# Altium schematic sheet ethernet.SchDoc
size A
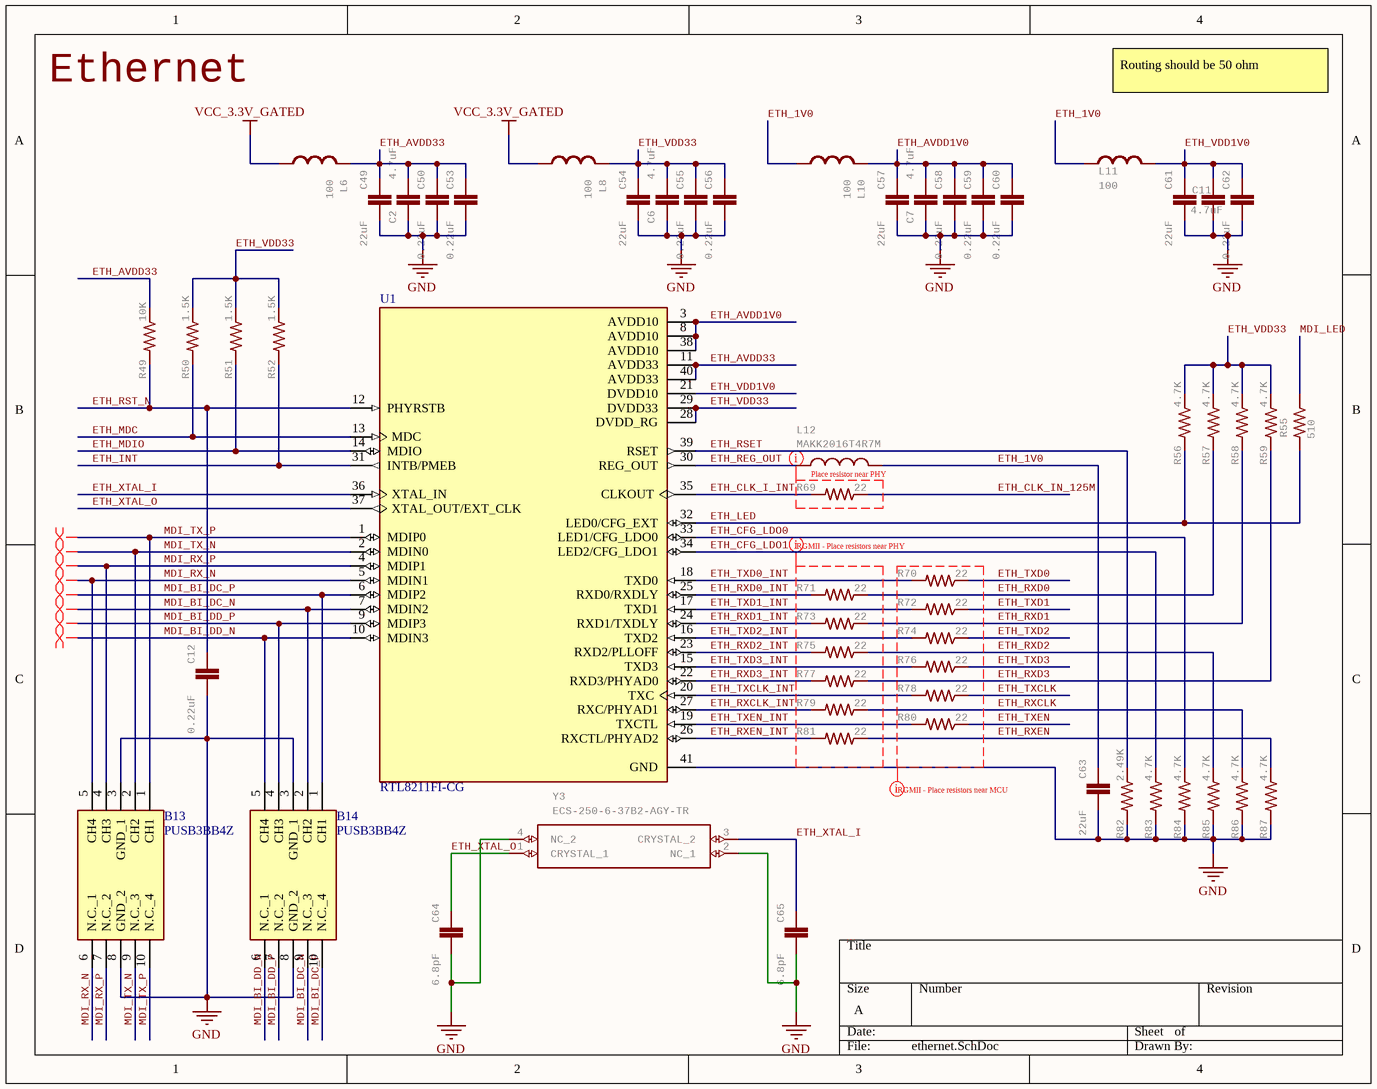
[diagram p0: ethernet.SchDoc]

## Parts
B13  PUSB3BB4Z  [SON50P100X250X50-10N]
B14  PUSB3BB4Z  [SON50P100X250X50-10N]
C2  4.7uF  [0402-CAP]
C6  4.7uF  [0402-CAP]
C7  4.7uF  [0402-CAP]
C11  4.7uF  [0402-CAP]
C12  0.22uF  [C0201]
C49  22uF  [0603-CAP]
C50  0.22uF  [C0201]
C53  0.22uF  [C0201]
C54  22uF  [0603-CAP]
C55  0.22uF  [C0201]
C56  0.22uF  [C0201]
C57  22uF  [0603-CAP]
C58  0.22uF  [C0201]
C59  0.22uF  [C0201]
C60  0.22uF  [C0201]
C61  22uF  [0603-CAP]
C62  0.22uF  [C0201]
C63  22uF  [0603-CAP]
C64  6.8pF  [C0201]
C65  6.8pF  [C0201]
L6  100  [C0402]
L8  100  [C0402]
L10  100  [C0402]
L11  100  [C0402]
L12  MAKK2016T4R7M  [INDC2016X100N]
R49  10K  [R0201]
R50  1.5K  [R0201]
R51  1.5K  [R0201]
R52  1.5K  [R0201]
R55  510  [0402-RES]
R56  4.7K  [R0201]
R57  4.7K  [R0201]
R58  4.7K  [R0201]
R59  4.7K  [R0201]
R69  22  [R0201]
R70  22  [R0201]
R71  22  [R0201]
R72  22  [R0201]
R73  22  [R0201]
R74  22  [R0201]
R75  22  [R0201]
R76  22  [R0201]
R77  22  [R0201]
R78  22  [R0201]
R79  22  [R0201]
R80  22  [R0201]
R81  22  [R0201]
R82  2.49K  [R0201]
R83  4.7K  [R0201]
R84  4.7K  [R0201]
R85  4.7K  [R0201]
R86  4.7K  [R0201]
R87  4.7K  [R0201]
U1  RTL8211FI-CG  [RTL8211FI-CG]
Y3  ECS-250-6-37B2-AGY-TR  [XRCGB24M000F3M00R0]

## Nets
GND: B13.3(GND_1) B13.8(GND_2) B14.3(GND_1) B14.8(GND_2) C2.1 C6.1 C7.1 C11.1 C12.2 C49.2 C50.2 C53.2 C54.2 C55.2 C56.2 C57.2 C58.2 C59.2 C60.2 C61.2 C62.2 C63.2 C64.2 C65.2 R82.2 R83.2 R84.2 R85.2 R86.2 R87.2 U1.41(GND) Y3.2(NC_1) Y3.4(NC_2)
VCC_3.3V_GATED: L6.1 L8.1
ETH_1V0: C63.1 L10.1 L11.1 L12.2
ETH_AVDD1V0: C7.2 C57.1 C58.1 C59.1 C60.1 L10.2 U1.3(AVDD10) U1.8(AVDD10) U1.38(AVDD10)
ETH_AVDD33: C2.2 C49.1 C50.1 C53.1 L6.2 R49.1 U1.11(AVDD33) U1.40(AVDD33)
ETH_CFG_LDO0: R84.1 U1.33(LED1/CFG_LDO0)
ETH_CFG_LDO1: R83.1 U1.34(LED2/CFG_LDO1)
ETH_CLK_I_INT: R69.2 U1.35(CLKOUT)
ETH_CLK_IN_125M: R69.1
ETH_INT: R52.2 U1.31(INTB/PMEB)
ETH_LED: R55.2 R56.2 U1.32(LED0/CFG_EXT)
ETH_MDC: R50.2 U1.13(MDC)
ETH_MDIO: R51.2 U1.14(MDIO)
ETH_REG_OUT: L12.1 U1.30(REG_OUT)
ETH_RSET: R82.1 U1.39(RSET)
ETH_RST_N: C12.1 R49.2 U1.12(PHYRSTB)
ETH_RXCLK: R79.1 R86.1
ETH_RXCLK_INT: R79.2 U1.27(RXC/PHYAD1)
ETH_RXD0: R57.2 R71.1
ETH_RXD0_INT: R71.2 U1.25(RXD0/RXDLY)
ETH_RXD1: R58.2 R73.1
ETH_RXD1_INT: R73.2 U1.24(RXD1/TXDLY)
ETH_RXD2: R75.1 R85.1
ETH_RXD2_INT: R75.2 U1.23(RXD2/PLLOFF)
ETH_RXD3: R59.2 R77.1
ETH_RXD3_INT: R77.2 U1.22(RXD3/PHYAD0)
ETH_RXEN: R81.1 R87.1
ETH_RXEN_INT: R81.2 U1.26(RXCTL/PHYAD2)
ETH_TXCLK: R78.1
ETH_TXCLK_INT: R78.2 U1.20(TXC)
ETH_TXD0: R70.1
ETH_TXD0_INT: R70.2 U1.18(TXD0)
ETH_TXD1: R72.1
ETH_TXD1_INT: R72.2 U1.17(TXD1)
ETH_TXD2: R74.1
ETH_TXD2_INT: R74.2 U1.16(TXD2)
ETH_TXD3: R76.1
ETH_TXD3_INT: R76.2 U1.15(TXD3)
ETH_TXEN: R80.1
ETH_TXEN_INT: R80.2 U1.19(TXCTL)
ETH_VDD1V0: C11.2 C61.1 C62.1 L11.2 U1.21(DVDD10)
ETH_VDD33: C6.2 C54.1 C55.1 C56.1 L8.2 R50.1 R51.1 R52.1 R56.1 R57.1 R58.1 R59.1 U1.28(DVDD_RG) U1.29(DVDD33)
ETH_XTAL_I: C65.1 U1.36(XTAL_IN) Y3.3(CRYSTAL_2)
ETH_XTAL_O: C64.1 U1.37(XTAL_OUT/EXT_CLK) Y3.1(CRYSTAL_1)
MDI_BI_DC_N: B14.2(CH2) B14.9(N.C._3) U1.7(MDIN2)
MDI_BI_DC_P: B14.1(CH1) B14.10(N.C._4) U1.6(MDIP2)
MDI_BI_DD_N: B14.5(CH4) B14.6(N.C._1) U1.10(MDIN3)
MDI_BI_DD_P: B14.4(CH3) B14.7(N.C._2) U1.9(MDIP3)
MDI_LED: R55.1
MDI_RX_N: B13.5(CH4) B13.6(N.C._1) U1.5(MDIN1)
MDI_RX_P: B13.4(CH3) B13.7(N.C._2) U1.4(MDIP1)
MDI_TX_N: B13.2(CH2) B13.9(N.C._3) U1.2(MDIN0)
MDI_TX_P: B13.1(CH1) B13.10(N.C._4) U1.1(MDIP0)

## Layout directives
net class RGMII - Place resistors near PHY: (no net found under the mark)
net class RGMII - Place resistors near MCU: GND
differential pair: MDI_BI_DC_N, MDI_BI_DC_P, MDI_BI_DD_N, MDI_BI_DD_P, MDI_RX_N, MDI_RX_P, MDI_TX_N, MDI_TX_P
net class Place resistor near PHY: (no net found under the mark)

## Notes on the sheet
- Ethernet
- Routing should be 50 ohm

## Library data of the parts
B13 B14 = PUSB3BB4Z: PUSB3BB4 - Extremely low capacitance bidirectional ESD protection diode array@en-us; Manufacturer_Name: Nexperia; Geometry.Height: 0.5mm; Mouser Part Number: 771-PUSB3BB4Z; Mouser Price/Stock: https://www.mouser.co.uk/ProductDetail/Nexperia/PUSB3BB4Z?qs=1Kr7Jg1SGW9sIg06EAYF6Q%3D%3D; Manufacturer_Part_Number: PUSB3BB4Z; Datasheet Link: https://assets.nexperia.com/documents/short-data-sheet/PUSB3BB4_SDS.pdf
C2 C6 C7 C11 = CAP0402-CAP: CapacitorStandard 0603 ceramic capacitor, and 0.1" leaded capacitor.; MPN: JMK105BBJ475MV-F; GateName_1: G$1; SymbolName_1: CAP; DeviceName: 0402-CAP; LibraryName: sfe; DeviceSetName: CAP; Part Number: JMK105BBJ475MV-F
C12 C50 C53 C55 C56 C58-C60 C62 = C-EUC0201: CAPACITOR, European symbol; MPN: GRM033R60J224ME15D; GateName_1: G$1; SymbolName_1: C-EU; POPULARITY: 0; DeviceName: C0201; LibraryName: rcl; DeviceSetName: C-EU; SPICEPREFIX: C; Part Number: GRM033R60J224ME15D
C49 C54 C57 C61 C63 = 22UF-0805-6.3V-20%: 22ÂµF ceramic capacitors    A capacitor is a passive two-terminal electrical component used to store electrical energy temporarily in an electric field.; MPN: GRM188R60G226MEA0D; GateName_1: G$1; SymbolName_1: CAP; PROD_ID: CAP-08402; DeviceName: -0805-6.3V-20%; LibraryName: SparkFun-Capacitors; DeviceSetName: 22UF; Part Number: GRM188R60G226MEA0D
C64 C65 = C-EUC0201: CAPACITOR, European symbol; MPN: GRM0335C1H6R8BA01D; GateName_1: G$1; SymbolName_1: C-EU; POPULARITY: 0; DeviceName: C0201; LibraryName: rcl; DeviceSetName: C-EU; SPICEPREFIX: C; Part Number: GRM0335C1H6R8BA01D
L6 L8 L10 L11 = INDUCTOR0402: InductorsBasic Inductor/Choke - 0603 and 1206. Footprints are not proven and vary greatly between part numbers.; MPN: MFBM1V1005-101-R; GateName_1: G$1; DeviceName: 0402; SymbolName_1: INDUCTOR; LibraryName: sfe; DeviceSetName: INDUCTOR; Part Number: MFBM1V1005-101-R
L12 = MAKK2016T2R2M: INDUCTOR, METAL CORE Check availability; GateName_1: G$1; MF: Taiyo Yuden; SymbolName_1: MAKK2016T4R7M; LibraryName: MAKK2016T4R7M; DeviceSetName: MAKK2016T4R7M; AVAILABILITY: In Stock; MP: MAKK2016T4R7M; MPN: MAKK2016T4R7M; PACKAGE: 2016 Taiyo Yuden; PRICE: None; PURCHASE-URL: https://pricing.snapeda.com/search/part/MAKK2016T4R7M/?ref=eda; Part Number: MAKK2016T4R7M
R49 = RESISTOR0402-RES: MPN: CR0201-JW-103GLF; GateName_1: G$1; SymbolName_1: RESISTOR; LibraryName: sfe; DeviceSetName: RESISTOR; Part Number: CR0201-JW-103GLF
R50-R52 = RESISTOR0402-RES: MPN: AC0201JR-071K5L; GateName_1: G$1; SymbolName_1: RESISTOR; LibraryName: sfe; DeviceSetName: RESISTOR; Part Number: AC0201JR-071K5L
R55 = RESISTOR0402-RES: ResistorBasic schematic elements and footprints for 0603, 1206, and PTH resistors.; MPN: RC0402FR-07510RL; GateName_1: G$1; SymbolName_1: RESISTOR; DeviceName: 0402-RES; LibraryName: sfe; DeviceSetName: RESISTOR; Part Number: RC0402FR-07510RL
R56-R59 R83-R87 = RESISTOR0402-RES: MPN: CR0201-FW-4701GLF; GateName_1: G$1; SymbolName_1: RESISTOR; LibraryName: sfe; DeviceSetName: RESISTOR; Part Number: CR0201-FW-4701GLF
R69-R81 = RESISTOR0402-RES: MPN: CR0201-JW-220GLF; GateName_1: G$1; SymbolName_1: RESISTOR; LibraryName: sfe; DeviceSetName: RESISTOR; Part Number: CR0201-JW-220GLF
R82 = RESISTOR0402-RES: MPN: RC0201FR-072K49L; GateName_1: G$1; SymbolName_1: RESISTOR; LibraryName: sfe; DeviceSetName: RESISTOR; Part Number: RC0201FR-072K49L
U1 = RTL8211F-CG: GbE PHY with RGMIII interface & EEE feature (Switch Regulator), QFN40; MF: Realtek Semiconductor Corp; Package: None; Pin Count: 41; Availability: In Stock; Price: None; Value: *; SnapEDA_Link: https://www.snapeda.com/parts/RTL8211F-CG/Realtek/view-part/?ref=snap; Design Item ID: RTL8211F-CG; Component Type: Standard; Check_prices: https://www.snapeda.com/parts/RTL8211F-CG/Realtek/view-part/?ref=eda; MP: RTL8211F-CG; Source: RTL8211F-CG.SchLib; Part Number: RTL8211FI-CG; MPN: RTL8211FI-CG
Y3 = XRCGB24M000F3M00R0: Murata 48MHz Crystal +/-30ppm SMD 4-Pin 2 x 1.6 x 0.7mm   Source:  Datasheet; MANUFACTURER_NAME: Murata Electronics; MANUFACTURER_PART_NUMBER: XRCGB48M000F0L00R0; GateName_1: G$1; SymbolName_1: ECS-250-6-37B2-AGY-TR; LibraryName: ECS-250-6-37B2-AGY-TR; DeviceSetName: ECS-250-6-37B2-AGY-TR; HEIGHT: mm; MOUSER_PART_NUMBER: 81-XRCGB48M000F0L00R0; MOUSER_PRICE-STOCK: https://www.mouser.com/ProductDetail/Murata-Electronics/XRCGB48M000F0L00R0?qs=e%252BE4OD6MgMeeUSmgUp7uPA%3D%3D; MPN: XRCGB48M000F0L00R0; Part Number: XRCGB48M000F0L00R0